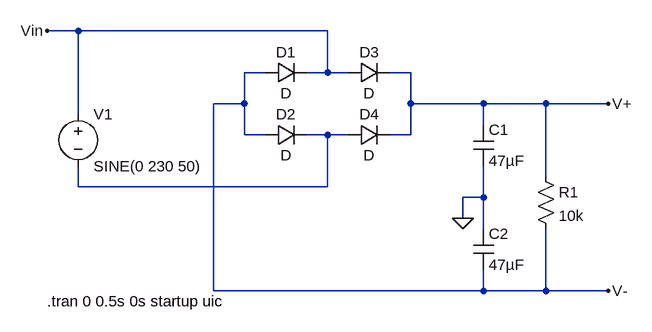
[diagram p0: schematic Center-Tapped-Full-Wave-Rectifier.asc]
Center-Tapped-Full-Wave-Rectifier.asc, the LTspice schematic file:
Version 4
SHEET 1 1444 680
WIRE -384 80 -432 80
WIRE 0 80 -384 80
WIRE -96 144 -128 144
WIRE 0 144 0 80
WIRE 0 144 -32 144
WIRE 32 144 0 144
WIRE 128 144 96 144
WIRE -128 192 -128 144
WIRE -128 192 -176 192
WIRE 128 192 128 144
WIRE 240 192 128 192
WIRE 336 192 240 192
WIRE 432 192 336 192
WIRE -384 208 -384 80
WIRE 240 224 240 192
WIRE -128 240 -128 192
WIRE -96 240 -128 240
WIRE 0 240 -32 240
WIRE 32 240 0 240
WIRE 128 240 128 192
WIRE 128 240 96 240
WIRE 336 304 336 192
WIRE -384 320 -384 288
WIRE 0 320 0 240
WIRE 0 320 -384 320
WIRE 240 336 240 288
WIRE 240 336 208 336
WIRE 208 368 208 336
WIRE 240 384 240 336
WIRE -176 480 -176 192
WIRE 240 480 240 448
WIRE 240 480 -176 480
WIRE 336 480 336 384
WIRE 336 480 240 480
WIRE 432 480 336 480
FLAG 208 368 0
FLAG 432 192 V+
FLAG -432 80 Vin
FLAG 432 480 V-
SYMBOL voltage -384 192 R0
WINDOW 123 0 0 Left 0
WINDOW 39 0 0 Left 0
SYMATTR InstName V1
SYMATTR Value SINE(0 230 50)
SYMBOL diode -96 160 R270
WINDOW 0 32 32 VTop 2
WINDOW 3 0 32 VBottom 2
SYMATTR InstName D1
SYMBOL diode -96 256 R270
WINDOW 0 32 32 VTop 2
WINDOW 3 0 32 VBottom 2
SYMATTR InstName D2
SYMBOL diode 32 160 R270
WINDOW 0 32 32 VTop 2
WINDOW 3 0 32 VBottom 2
SYMATTR InstName D3
SYMBOL diode 32 256 R270
WINDOW 0 32 32 VTop 2
WINDOW 3 0 32 VBottom 2
SYMATTR InstName D4
SYMBOL cap 224 224 R0
SYMATTR InstName C1
SYMATTR Value 47µF
SYMBOL res 320 288 R0
SYMATTR InstName R1
SYMATTR Value 10k
SYMBOL cap 224 384 R0
SYMATTR InstName C2
SYMATTR Value 47µF
TEXT -432 496 Left 2 !.tran 0 0.5s 0s startup uic

The netlist it stands for:
* Center-Tapped-Full-Wave-Rectifier.asc
V1 Vin N001 SINE(0 230 50)
D1 V- Vin D
D2 V- N001 D
D3 Vin V+ D
D4 N001 V+ D
C1 V+ 0 47µF
R1 V+ V- 10k
C2 0 V- 47µF
.model D D
.lib standard.dio
.tran 0 0.5s 0s startup uic
.backanno
.end